# EAGLE design RFToy (EAGLE 7.1.0)
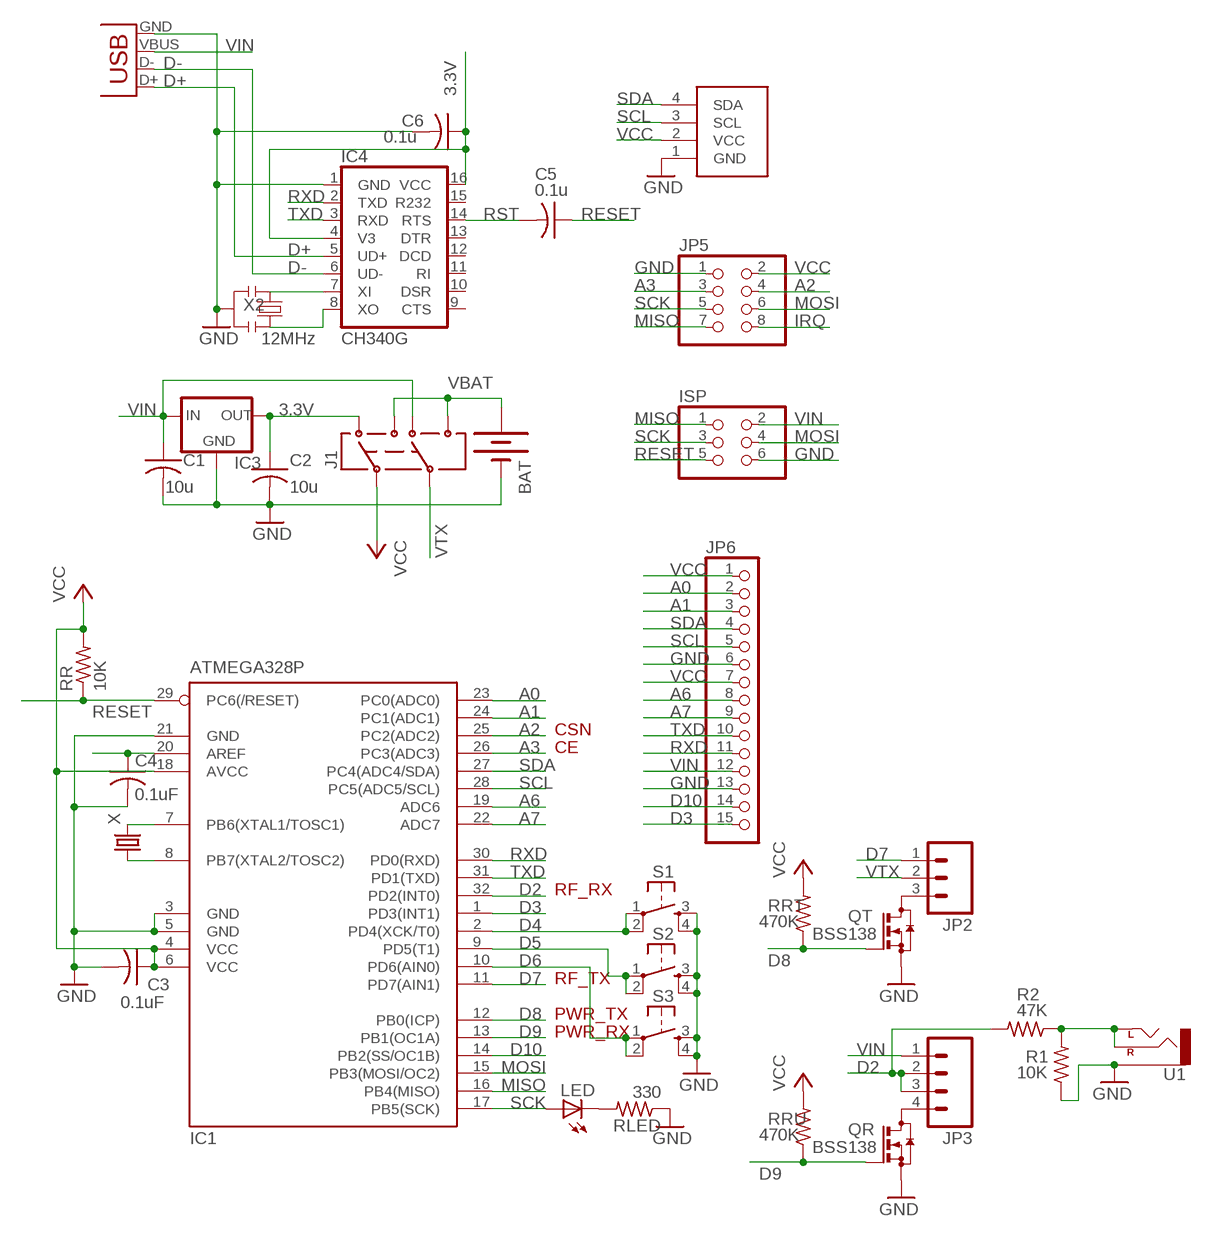
[diagram p0: schematic, sheet 1]

## Parts
BAT  BATTERY20PTH  [BATTCOM_20MM_PTH]
C1  10u  C-USC0805K  [C0805K]
C2  10u  C-USC0805K  [C0805K]
C3  0.1uF  C-USC0805K  [C0805K]
C4  0.1uF  C-USC0805K  [C0805K]
C5  0.1u  C-USC0805K  [C0805K]
C6  0.1u  C-USC0805K  [C0805K]
IC1  ATMEGA328P  MEGA8-AI  [TQFP32-08]
IC3  MCP1700SOT233  [SOT23]
IC4  CH340G  [SO16]
ISP  PINHD-2X3  [2X03]
J1  AYZ0202  [AYZ0202]
JP2  M03LOCK_LONGPADS  [1X03_LOCK_LONGPADS]
JP3  M04LOCK  [1X04_LOCK]
JP5  PINHD-2X4  [2X04]
JP6  PINHD-1X15-CB  [1X15-CB]
LED  LEDCHIPLED_0805  [CHIPLED_0805]
QR  BSS138  BSS123  [SOT23]
QT  BSS138  BSS123  [SOT23]
R1  10K  R-US_R0805  [R0805]
R2  47K  R-US_R0805  [R0805]
RLED  330  R-US_R0805  [R0805]
RR  10K  R-US_R0805  [R0805]
RRT  470K  R-US_R0805  [R0805]
RRU  470K  R-US_R0805  [R0805]
S1  TAC_SWITCHPTH  [TACTILE-PTH]
S2  TAC_SWITCHPTH  [TACTILE-PTH]
S3  TAC_SWITCHPTH  [TACTILE-PTH]
U1  AUDIO-JACKPTH  [AUDIO-JACK]
U$1  SSD1306_OLED_I2C  [SSD1306_OLED_I2C]
X  CRYSTALTC26V  [TC26V]
X1  USBSMD  [USB-MINIB]
X2  12MHz  RESONATORSMD  [RESONATOR-SMD]

## Nets
3.3V [power]: C2.1 C6.1 IC3.2(OUT) IC4.4(V3) IC4.16(VCC) J1.3
A0: IC1.23(PC0(ADC0)) JP6.2
A1: IC1.24(PC1(ADC1)) JP6.3
A2: IC1.25(PC2(ADC2)) JP5.4
A3: IC1.26(PC3(ADC3)) JP5.3
A6: IC1.19(ADC6) JP6.8
A7: IC1.22(ADC7) JP6.9
AREF: C4.1 IC1.20(AREF)
D2: IC1.32(PD2(INT0)) JP3.2 JP3.3 R2.2
D3: IC1.1(PD3(INT1)) JP6.15
D4: IC1.2(PD4(XCK/T0)) S1.1 S1.2
D5: IC1.9(PD5(T1)) S2.1 S2.2
D6: IC1.10(PD6(AIN0)) S3.1 S3.2
D7: IC1.11(PD7(AIN1)) JP2.1
D8: IC1.12(PB0(ICP)) QT.1(G) RRT.1
D9: IC1.13(PB1(OC1A)) QR.1(G) RRU.1
D10: IC1.14(PB2(SS/OC1B)) JP6.14
D+: IC4.5(UD+) X1.D+
D-: IC4.6(UD-) X1.D-
GND [power]: BAT.2(-) C1.2 C2.2 C3.2 C4.2 C6.2 IC1.3(GND) IC1.5(GND) IC1.21(GND) IC3.1(GND) IC4.1(GND) ISP.6 JP5.1 JP6.6 JP6.13 QR.2(S) QT.2(S) R1.1 RLED.1 S1.3 S1.4 S2.3 S2.4 S3.3 S3.4 U1.SLEEVE U$1.1(GND) X1.GND X2.2
IRQ: JP5.8
MISO: IC1.16(PB4(MISO)) ISP.1 JP5.7
MOSI: IC1.15(PB3(MOSI/OC2)) ISP.4 JP5.6
N$1: LED.C RLED.2
N$2: IC1.7(PB6(XTAL1/TOSC1)) X.2
N$3: IC1.8(PB7(XTAL2/TOSC2)) X.1
N$4: R1.2 R2.1 U1.RING(RIGHT) U1.TIP(LEFT)
N$6: JP3.4 QR.3(D)
N$8: JP2.3 QT.3(D)
N$11: IC4.7(XI) X2.1
N$13: IC4.8(XO) X2.3
RESET: C5.1 IC1.29(PC6(/RESET)) ISP.5 RR.1
RST: C5.2 IC4.14(RTS)
RXD: IC1.30(PD0(RXD)) IC4.2(TXD) JP6.11
SCK: IC1.17(PB5(SCK)) ISP.3 JP5.5 LED.A
SCL: IC1.28(PC5(ADC5/SCL)) JP6.5 U$1.3(SCL)
SDA: IC1.27(PC4(ADC4/SDA)) JP6.4 U$1.4(SDA)
TXD: IC1.31(PD1(TXD)) IC4.3(RXD) JP6.10
VBAT [power]: BAT.1(+) J1.1 J1.4
VCC: C3.1 IC1.4(VCC) IC1.6(VCC) IC1.18(AVCC) J1.2 JP5.2 JP6.1 JP6.7 RR.2 RRT.2 RRU.2 U$1.2(VCC)
VIN [power]: C1.1 IC3.3(IN) ISP.2 J1.6 JP3.1 JP6.12 X1.VBUS
VTX [power]: J1.5 JP2.2
Unconnected: IC4.9(CTS) IC4.10(DSR) IC4.11(RI) IC4.12(DCD) IC4.13(DTR) IC4.15(R232)

## Notes on the sheet
- CSN
- CE
- RF_RX
- RF_TX
- PWR_TX
- PWR_RX

## Library data of the parts
BAT = SparkFun:BATTERY: Battery Holders Various common sizes : AA, AAA, 20mm coin cell and 12mm coin cell.
C1-C4 = adafruit2013:C-US: CAPACITOR, American symbol
C5 C6 = adafruit:C-US: CAPACITOR, American symbol
IC1 = atmel:MEGA8: MICROCONTROLLER 8 Kbytes FLASH, 1 kbytes SRAM, 512 bytes EEPROM, USART, 6-channel 10 bit ADC, 2-channel 8 bit ADC Pin compatible with Atmega48, ATMega88, ATMega168 Source: avr.lbr; MPN: ATMEGA8-16AU; OC_FARNELL: 9171371; OC_NEWARK: 73M8863
IC3 = adafruit:MCP1700: VOLTAGE REGULATOR
IC4 = SparkFunNew:CH340
ISP = pinhead:PINHD-2X3: PIN HEADER
J1 = SparkFunNew:AYZ0202: SPDT Slide Switch Simple SMD single-pull double-throw slide switch. Good for less than 350mA power switch, switching UARTs between devices, etc. Spark Fun Electronics SKU : COM-00597
JP2 = SparkFun:M03: Header 3 Standard 3-pin 0.1" header. Use with straight break away headers (SKU : PRT-00116), right angle break away headers (PRT-00553), swiss pins (PRT-00743), machine pins (PRT-00117), and female headers (PRT-00115). Molex polarized connector foot print use with SKU : PRT-08232 with associated crimp pins and housings.
JP3 = SparkFun:M04: Header 4 Standard 4-pin 0.1" header. Use with straight break away headers (SKU : PRT-00116), right angle break away headers (PRT-00553), swiss pins (PRT-00743), machine pins (PRT-00117), and female headers (PRT-00115). Molex polarized connector foot print use with SKU : PRT-08231 with associated crimp pins and housings.
JP5 = adafruit2013:PINHD-2X4: PIN HEADER
JP6 = adafruit2013:PINHD-1X15: PIN HEADER
LED = adafruit:LED: LED OSRAM: - CHIPLED LG R971, LG N971, LY N971, LG Q971, LY Q971, LO R971, LY R971 LH N974, LH R974 LS Q976, LO Q976, LY Q976 LO Q996 - Hyper CHIPLED LW Q18S LB Q993, LB Q99A, LB R99A - SideLED LS A670, LO A670, LY A670, LG A670, LP A670 LB A673, LV A673, LT A673, LW A673 LH A674 LY A675 LS A676, LA A676, LO A676, LY A676, LW A676 LS A679, LY A679, LG A679 - Hyper Micro SIDELED® LS Y876, LA Y876, LO Y876, LY Y876 LT Y87S - SmartLED LW L88C, LW L88S LB L89C, LB L89S, LG L890 LS L89K, LO L89K, LY L89K LS L896, LA L896, LO L896, LY L896 - TOPLED LS T670, LO T670, LY T670, LG T670, LP T670 LSG T670, LSP T670, LSY T670, LOP T670, LYG T670 LG T671, LOG T671, LSG T671 LB T673, LV T673, LT T673, LW T673 LH T674 LS T676, LA T676, LO T676, LY T676, LB T676, LH T676, LSB T676, LW T676 LB T67C, LV T67C, LT T67C, LS T67K, LO T67K, LY T67K, LW E67C LS E67B, LA E67B, LO E67B, LY E67B, LB E67C, LV E67C, LT E67C LW T67C LS T679, LY T679, LG T679 LS T770, LO T770, LY T770, LG T770, LP T770 LB T773, LV T773, LT T773, LW T773 LH T774 LS E675, LA E675, LY E675, LS T675 LS T776, LA T776, LO T776, LY T776, LB T776 LHGB T686 LT T68C, LB T68C - Hyper Mini TOPLED® LB M676 - Mini TOPLED Santana® LG M470 LS M47K, LO M47K, LY M47K Source: http://www.osram.convergy.de/
QR QT = transistor-small-signal:BSS123: N-CHANNEL MOS FET
R1 R2 RLED RR RRT RRU = adafruit2013:R-US_: RESISTOR, American symbol
S1-S3 = SparkFunNew:TAC_SWITCH: Momentary Switch Button commonly used for reset or general input. Spark Fun Electronics SKU : COM-00097
U1 = SparkFunNew:AUDIO-JACK: 3.5mm Audio Jack Simple 3.5mm common PCB mount audio jack. SKU: PRT-08032
U$1 = adafruit2013:SSD1306_OLED_I2C
X = adafruit2013:CRYSTAL: CRYSTAL; OC_FARNELL: unknown; OC_NEWARK: unknown
X1 = SparkFun:USB: USB Connectors USB-B-PTH is fully proven SKU : PRT-00139 USB-miniB is fully proven SKU : PRT-00587 USB-A-PCB is untested. USB-A-H is throughly reviewed, but untested. Spark Fun Electronics SKU : PRT-00437 USB-B-SMT is throughly reviewed, but untested. Needs silkscreen touching up. USB-A-S has not been used/tested USB-MB-H has not been used/tested
X2 = SparkFunNew:RESONATOR: Resonator Small SMD resonator. This is the itty bitty 10/20MHz resonators with built in caps. CSTCE10M0G55 and CSTCE20M0V53. Footprint has been reviewed closely but hasn't been tested yet.

## Net classes
0 default: width 0.178 mm, clearance 0.178 mm
1 power: width 0.203 mm, clearance 0.203 mm

## Board
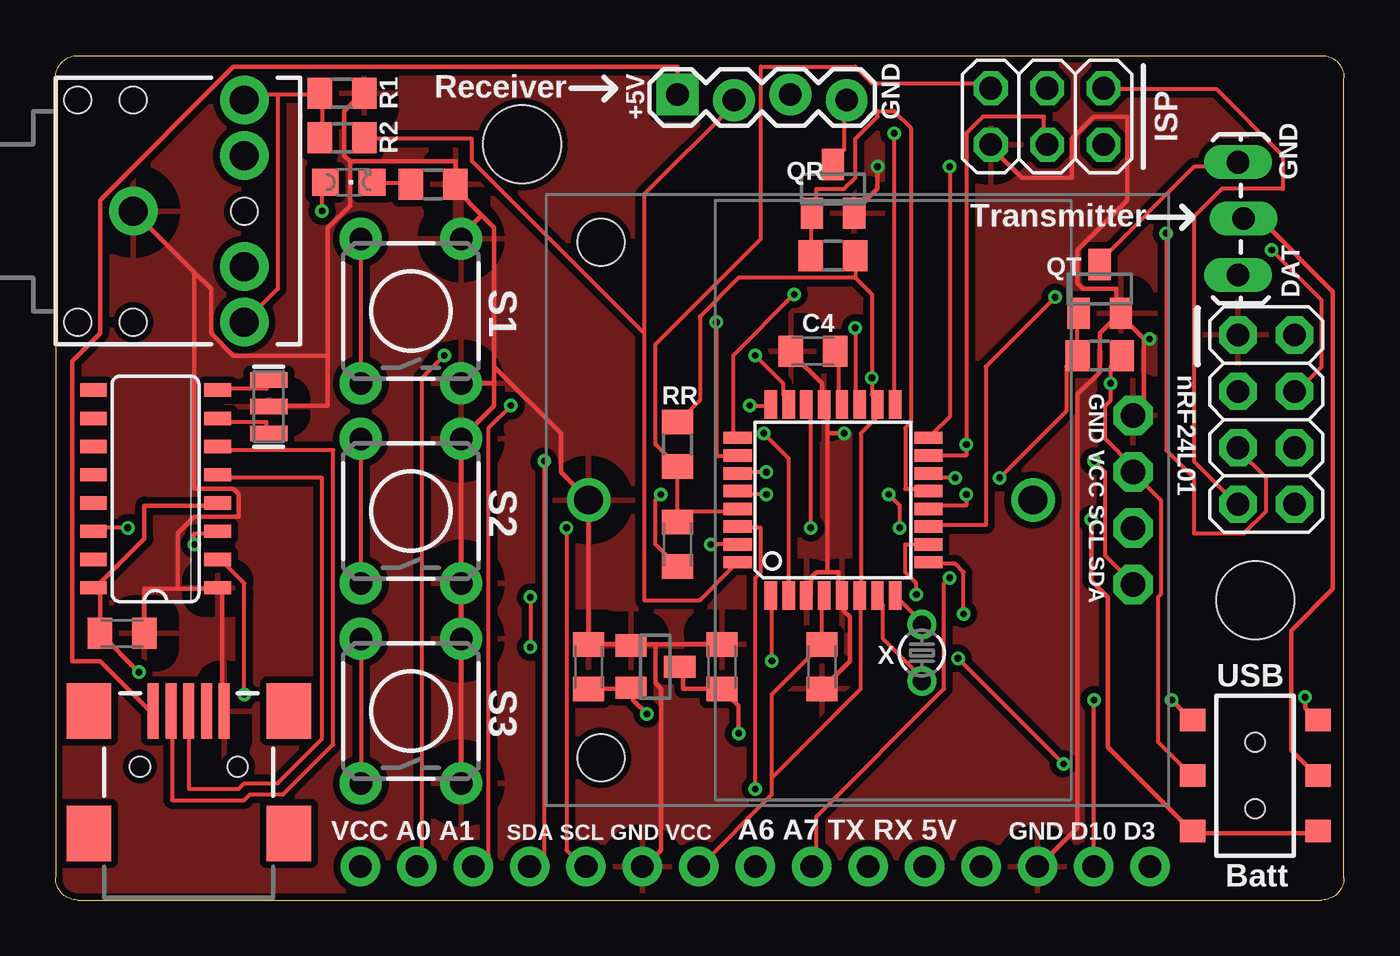
[diagram p1: board, top side]
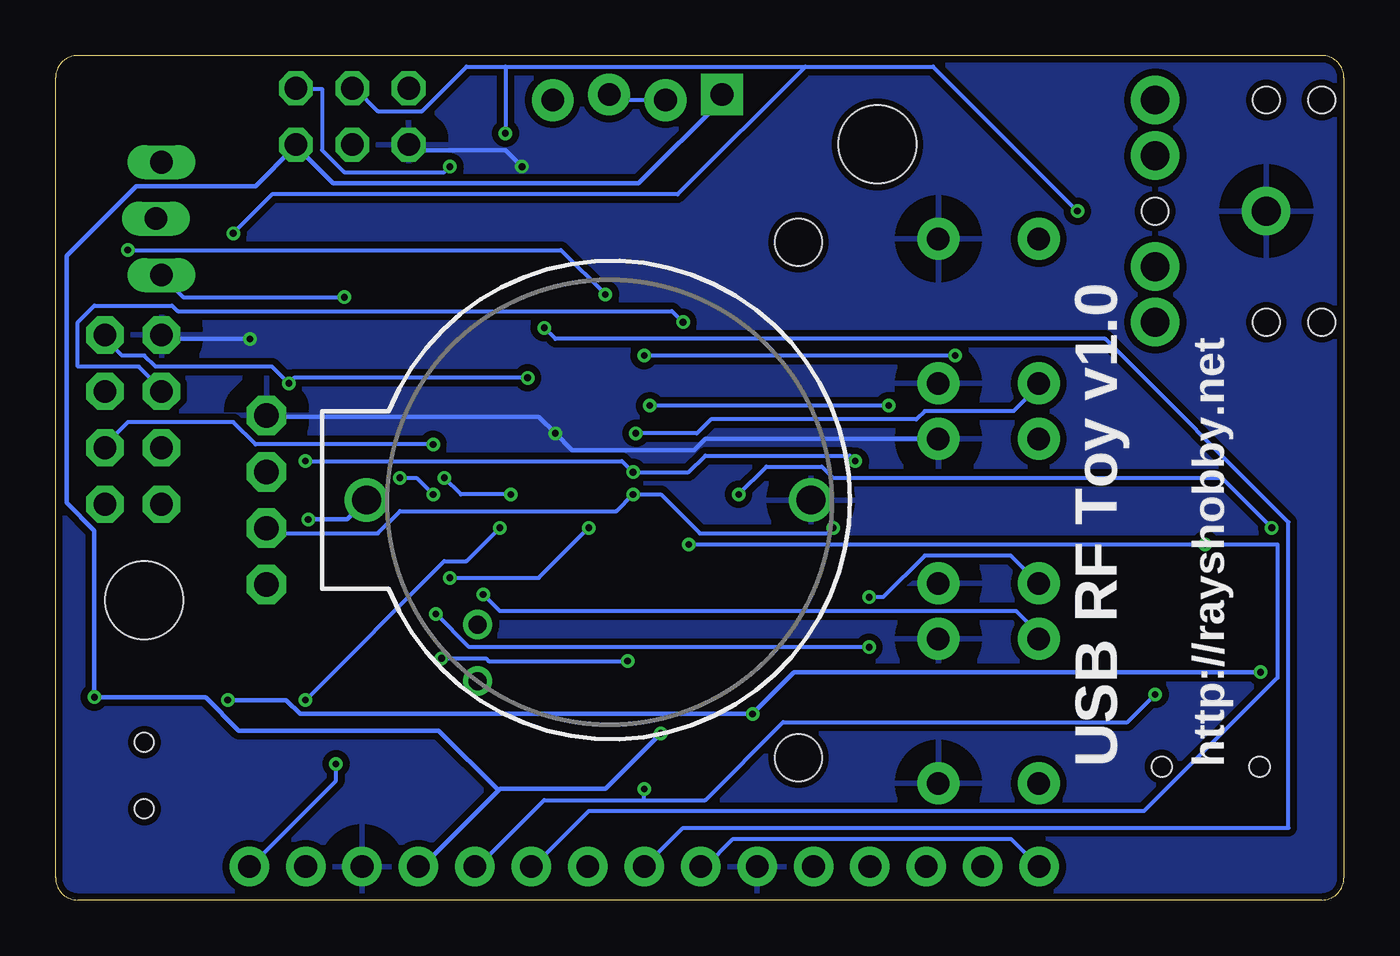
[diagram p2: board, bottom side, seen from below]

Size 58 x 38 mm. Coordinates in mm from the lower left corner, seen from the top.
Outline: 0,37 0,1 arc90 1,0 57,0 arc90 58,1 58,37 arc90 57,38 1,38 arc90 0,37
Copper layers (1*16): Top 0.035mm / dielectric 1.5mm / Bottom 0.035mm
Design rules "Fusion_eagle_rule_v1.1 *": minimum track width 6mil, minimum drill 12mil, track to track 6mil, track to pad 6mil, pad to pad 6mil, via to via 6mil, smd to smd 0mil, copper to edge 10mil, drill to drill 10mil, minimum pad ring 10mil, minimum via ring 6mil, stop-mask expansion 2mil, vias tented up to drill 100mil, thermal gap 40mil
Holes 3.5 mm at 21,34 54,13.5
vRestrict: area 50.5,17.8 to 51.3,23.6; area 55.2,27.1 to 56,29.2; area 55.1,32.4 to 55.9,34.5; area 37.2,35.1 to 38,37.2; area 25.7,35.1 to 26.5,37.2

### Footprints (pad centres in the part's own frame; a part is rotated, then mirrored left to right if it is on the bottom)
BATTCOM_20MM_PTH = drill 1.3: 1 20,0; 2 0,0
C0805K = smd 1.1 x 1.4: 1 -1,0; 2 1,0
TQFP32-08 = smd 1.27 x 0.559: 1 -4.293,2.8; 2 -4.293,2; 3 -4.293,1.2; 4 -4.293,0.4; 5 -4.293,-0.4; 6 -4.293,-1.2; 7 -4.293,-2; 8 -4.293,-2.8; 17 4.293,-2.8; 18 4.293,-2; 19 4.293,-1.2; 20 4.293,-0.4; 21 4.293,0.4; 22 4.293,1.2; 23 4.293,2; 24 4.293,2.8 | smd 0.559 x 1.27: 9 -2.8,-4.293; 10 -2,-4.293; 11 -1.2,-4.293; 12 -0.4,-4.293; 13 0.4,-4.293; 14 1.2,-4.293; 15 2,-4.293; 16 2.8,-4.293; 25 2.8,4.293; 26 2,4.293; 27 1.2,4.293; 28 0.4,4.293; 29 -0.4,4.293; 30 -1.2,4.293; 31 -2,4.293; 32 -2.8,4.293
SOT23 = smd 1 x 1.4: 1 -0.95,-1.1; 2 0.95,-1.1; 3 0,1.1
SO16 = smd 0.6 x 1.2: 1 -4.445,-2.8; 2 -3.175,-2.8; 3 -1.905,-2.8; 4 -0.635,-2.8; 5 0.635,-2.8; 6 1.905,-2.8; 7 3.175,-2.8; 8 4.445,-2.8; 9 4.445,2.8; 10 3.175,2.8; 11 1.905,2.8; 12 0.635,2.8; 13 -0.635,2.8; 14 -1.905,2.8; 15 -3.175,2.8; 16 -4.445,2.8
2X03 = drill 1.016 octagon: 1 -2.54,-1.27; 2 -2.54,1.27; 3 0,-1.27; 4 0,1.27; 5 2.54,-1.27; 6 2.54,1.27
AYZ0202 = smd 1 x 1.15: 1 -2.5,2.825; 2 0,2.825; 3 2.5,2.825; 4 -2.5,-2.825; 5 0,-2.825; 6 2.5,-2.825 | hole 0.85: 1.5,0; -1.5,0
1X03_LOCK_LONGPADS = drill 1.016 long: 1 0,0; 2 2.54,-0.254; 3 5.08,0
1X04_LOCK = drill 1.016 pad 1.88 square: 1 0,0.127 | drill 1.016 pad 1.88: 2 2.54,-0.127; 3 5.08,0.127; 4 7.62,-0.127
2X04 = drill 1.016 pad 1.676 octagon: 1 -3.81,-1.27; 2 -3.81,1.27; 3 -1.27,-1.27; 4 -1.27,1.27; 5 1.27,-1.27; 6 1.27,1.27; 7 3.81,-1.27; 8 3.81,1.27
1X15-CB = drill 1.016 pad 1.778: 1 -17.78,0; 2 -15.24,0; 3 -12.7,0; 4 -10.16,0; 5 -7.62,0; 6 -5.08,0; 7 -2.54,0; 8 0,0; 9 2.54,0; 10 5.08,0; 11 7.62,0; 12 10.16,0; 13 12.7,0; 14 15.24,0; 15 17.78,0
CHIPLED_0805 = smd 1.2 x 1.2: A 0,-1.05; C 0,1.05
R0805 = smd 1.1 x 1.4: 1 -1,0; 2 1,0
TACTILE-PTH = drill 1.016 pad 1.88: 1 -3.251,2.261; 2 3.251,2.261; 3 -3.251,-2.261; 4 3.251,-2.261
AUDIO-JACK = drill 1.3 pad 2.184: RING 5,5; RSH 5,2.5; SLEEVE 0,0; TIP 5,-5; TSH 5,-2.5 | hole 1.2: 0,5; -2.5,5; -2.5,-5; 0,-5; 5,0
SSD1306_OLED_I2C = drill 1.1 pad 1.778 octagon: 1 -3.81,0; 2 -1.27,0; 3 1.27,0; 4 3.81,0 | hole 2.1: 11.6,-23.95; -11.6,-23.95
TC26V = drill 0.813: 1 -1.27,0; 2 1.27,0
USB-MINIB = smd 2.5 x 0.5: D+ 2.5,0; D- 2.5,0.8; GND 2.5,-1.6; ID 2.5,-0.8; VBUS 2.5,1.6 | smd 2.5 x 2: GND@1 -3,-4.5; GND@2 -3,4.5; GND@3 2.5,4.5; GND@4 2.5,-4.5 | hole 0.9: 0,2.2; 0,-2.2
RESONATOR-SMD = smd 0.7 x 1.7: 1 -1.2,0; 2 0,0; 3 1.2,0

### Placement (x,y rotation side)
BAT  24,18 180 bottom
C1  30,10.5 90 top
C2  24,10.5 90 top
C3  34.5,10.5 270 top
C4  34.1,24.7 180 top
C5  28,16 270 top
C6  3,12 0 top
IC1  35,18 90 top
IC3  27,10.5 270 top
IC4  4.5,18.5 90 top
ISP  44.64,35.26 180 top
J1  54,5.6 90 top
JP2  53.23,28.12 90 top
JP3  28,36.12 0 top
JP5  54.5,21.62 270 top
JP6  31.5,1.5 0 top
LED  13.2,32.3 270 top
QR  35,32 0 top
QT  47,27.5 0 top
R1  12.9,36.3 180 top
R2  12.9,34.3 0 top
RLED  17,32.2 180 top
RR  28,20.5 90 top
RRT  47,24.5 0 top
RRU  35,29 0 top
S1  16,26.5 90 top
S2  16,17.5 90 top
S3  16,8.5 90 top
U1  3.5,31 0 top
U$1  48.5,18 270 top
X  39,11.12 270 top
X1  6,6 90 top
X2  9.6,22.2 90 top

### Tracks (layer width: path | path; a pad name or v marks a point on that pad's centre or on a via)
3.3V  (via drill 0.3)
  Top 0.203: 1.75,14 2,13.75 C6.1 v3.75,10.25 | 1.75,14 4,16.25 4,17.75 7.25,17.75 IC4.4 | 1.75,14 IC4.16 | C2.1 25.75,9.5 IC3.2 26,9.5 26,9 v26.62,8.38 | v50.25,9 51.12,8.12 J1.3
  Bottom 0.203: v50.25,9 47.62,9 47,8.38 v26.62,8.38 24.75,10.25 v3.75,10.25
A0  (via drill 0.3)
  Top 0.178: v31.5,24.5 32.75,23.25 32.75,22.75 33,22.5 IC1.23 | v17.5,24.5 16.5,23.5 16.5,1.5 JP6.2
  Bottom 0.178: v17.5,24.5 v31.5,24.5
A1  (via drill 0.3)
  Top 0.178: v31.25,22.25 32,22.25 IC1.24 | v20.5,22.25 19.5,21.25 19.5,2 19,1.5 JP6.3
  Bottom 0.178: v20.5,22.25 v31.25,22.25
A2  (via drill 0.3)
  Top 0.178: v33.25,27.25 30.5,24.5 30.5,21 IC1.25 | v54.75,29.25 57,27 57,24 56,23 JP5.4
  Bottom 0.178: v33.25,27.25 35.25,29.25 v54.75,29.25
A3  (via drill 0.3)
  Top 0.178: IC1.26 29.75,20 v29.75,26
  Bottom 0.178: v29.75,26 30.25,26.5 52.5,26.5 52.75,26.75 56.25,26.75 57,26 57,24 54.25,24 53.25,23 JP5.3
A6  (via drill 0.3)
  Top 0.178: v36,25.75 36,22.5 IC1.19
  Bottom 0.178: v36,25.75 35.5,25.25 10.75,25.25 2.5,17 2.5,3.25 29.75,3.25 JP6.8
A7  (via drill 0.3)
  Top 0.178: v34,16.75 34,22.25 IC1.22 | v40.25,14.5 40,14.25 40,9.5 34.25,3.75 34.25,1.5 JP6.9
  Bottom 0.178: v34,16.75 36.25,14.5 v40.25,14.5
AREF
  Top 0.178: IC1.20 35.25,22.5 35.25,24.5 C4.1
D2
  Top 0.178: 26.5,25.5 26.5,31.75 30.5,35.75 JP3.2 | 26.5,25.5 26.5,13.5 29,13.5 30.5,15 IC1.32 | 26.5,25.5 18.75,33.25 18.75,34.25 14,34.25 R2.2
  Bottom 0.178: JP3.3 33,36 30.75,36 JP3.2
D3  (via drill 0.3)
  Top 0.178: v32.25,10.75 32.25,13.62 IC1.1 | v45.38,6.12 v40.62,10.88
  Bottom 0.178: v32.25,10.75 38.5,10.75 38.62,10.88 v40.62,10.88 | v45.38,6.12 45.38,5.38 49.25,1.5 JP6.15
D4  (via drill 0.3)
  Top 0.178: IC1.2 33,19.88 v31.88,21 | S1.2 S1.1
  Bottom 0.178: v31.88,21 29.12,21 28.5,21.62 19.25,21.62 18.88,22 14.88,22 13.75,23.12 S1.1
D5  (via drill 0.3)
  Top 0.178: v40.88,12.88 40.88,14.75 40.5,15.12 39.38,15.12 IC1.9 | v21.38,13.62 v21.38,11.38 | S2.2 S2.1
  Bottom 0.178: v40.88,12.88 39.38,11.38 v21.38,11.38 | v21.38,13.62 20.75,13.62 18.88,15.5 15,15.5 S2.1
D6  (via drill 0.3)
  Top 0.178: IC1.10 38.25,16 38.25,14.75 38.75,14.25 v38.75,13.75 | S3.1 S3.2
  Bottom 0.178: v38.75,13.75 38,13 14.75,13 13.75,12 S3.2
D7  (via drill 0.3)
  Top 0.178: v45,27.12 41.88,24 41.88,16.88 39.38,16.88 IC1.11
  Bottom 0.178: v45,27.12 52.25,27.12 53.12,28 JP2.1
D8  (via drill 0.3)
  Top 0.178: v41,18.25 41,17.75 39.5,17.75 IC1.12 | v42.5,19 45.5,22 45.5,24 RRT.1 46,26.25 QT.1
  Bottom 0.178: v41,18.25 41.75,19 v42.5,19
D9
  Top 0.178: IC1.13 39.25,18.5 38.25,18.5 38.25,21.25 38.5,21.5 38.5,34.75 37.75,35.5 37,35.5 37,35.25 36,34.25 36,32.5 35.5,32 34.25,32 34.25,31 QR.1 34,30.75 RRU.1
D10  (via drill 0.3)
  Top 0.178: v40.5,19 39.5,19 IC1.14 | v37.5,18.25 38,17.75 v38,16.75 | v46.75,9 JP6.14
  Bottom 0.178: v40.5,19 39.75,18.25 v37.5,18.25 | v38,16.75 39.5,15.25 40.5,15.25 v46.75,9
D+
  Top 0.178: X1.D+ 6,5 8.25,5 8.5,5.25 10,5.25 12,7.25 12,19 7.5,19 IC4.5
D-
  Top 0.178: IC4.6 7.5,20.25 12.5,20.25 12.5,7 10.25,4.75 8.75,4.75 8.5,4.5 5.25,4.5 5.25,8.5 X1.D-
GND  (via drill 0.3)
  Top 0.203: C4.2 33.25,24.5 34.5,23.25 34.5,22.5 IC1.21 34.75,22.25 34.75,21 | 34.75,14.75 35.25,14.75 35.25,13.75 IC1.5 35.5,13.5 35.5,13 35.75,12.75 35.75,10.75 C3.2 | 34.75,14.75 34.25,14.75 34,14.5 34,13.75 IC1.3 | 34.75,14.75 34.75,21 | v37,33 37,32 36,31 QR.2 | 49,25.25 48,26.25 QT.2 | 49,25.25 49,22.5 48.5,22 U$1.1 | 49,25.25 v49.25,25.25 | JP6.13 44.25,1.5 46,3.25 46,22.75 47,23.75 47,25.5 47.75,26.25 QT.2 | ISP.6 42.25,33.75 43.5,32.5 45.75,32.5 45.75,34.25 46.75,35.25 48.25,35.25 48.25,31.5 46,29.25 46,27.75 46.25,27.5 47.75,27.5 47.75,26.5 QT.2 | v35.5,21 34.75,21 | 27,11.5 26,11.5 IC3.1 25.75,11.5 C2.2 BAT.2 22.75,19.25 22.75,21 19.75,24 | 27,11.5 C1.2 | 27,11.5 27,9.75 27.25,9.5 27.25,2.25 26.5,1.5 JP6.6 | S3.3 S3.4 18.25,12 18.25,14 S2.3 S2.4 18.5,21 19.75,22.25 19.75,23.25 | 5.5,14 4,14 C6.2 | 5.5,14 7.25,14 IC4.1 7.5,14 7.5,8.5 X1.GND | 13.25,33.25 13,33.5 13,35.5 13.75,36.25 R1.1 | 13.25,33.25 18,33.25 RLED.1 18,32 19.19,30.81 | 12.25,24.5 12.25,30.25 13.25,31.25 13.25,33.25 | 12.25,24.5 12.25,22.25 9.75,22.25 X2.2 | 6.25,28.25 7,27.5 7,25.5 8,24.5 12.25,24.5 | 6.25,28.25 U1.SLEEVE | 5.5,14 5.5,16.5 6.25,17.25 8.25,17.25 8.25,18.25 8,18.5 6.25,18.5 6.25,28.25 | 19.75,24 19.75,30.25 19.19,30.81 | 19.75,24 19.75,23.25 | 19.75,23.25 18.38,23.25 S1.3 | 19.19,30.81 18.25,29.88 S1.4
  Bottom 0.203: v37,33 37.75,33.75 42,33.75 ISP.6 | v49.25,25.25 53,25.25 JP5.1 | U$1.1 48.5,21.75 36.25,21.75 v35.5,21 34.75,20.25 29.25,20.25 28.75,20.75 18.5,20.75 S2.4
  pour Top (isolate 0.305): 0,38 58,38 58,0 0,0
  pour Bottom (isolate 0.305): 0,38 58,38 58,0 0,0
MISO  (via drill 0.3)
  Top 0.178: v40.25,33 40.25,21.75 39.5,21 IC1.16 | JP5.7 53,18 51.25,19.75 51.25,30.75 52.5,32 55.25,32 55.25,33.5 52.25,36.5 47.25,36.5 ISP.1
  Bottom 0.178: v40.25,33 40.5,32.75 45,32.75 46,33.75 46,36.5 47,36.5 ISP.1
MOSI  (via drill 0.3)
  Top 0.178: IC1.15 41,20 v41,20.5 41,34.5 41.75,35.25 44.5,35.25 44.5,34 ISP.4
  Bottom 0.178: v41,20.5 49,20.5 50,21.5 54.75,21.5 55.75,20.5 JP5.6
N$1
  Top 0.178: LED.C 14.25,32.25 16,32.25 RLED.2
N$2
  Top 0.178: IC1.7 37,13.5 37.25,13.25 37.25,11.75 39,10 X.2
N$3
  Top 0.178: IC1.8 38,13.5 39,12.5 X.1
N$4
  Top 0.178: R2.1 12,34.5 12,36.25 R1.2 11.75,36.25 10,36.25 | 10,36.25 8.5,36.25 U1.RING | U1.TIP 10,27.5 10,36.25
N$6
  Top 0.178: QR.3 35,33.25 35.5,33.75 35.5,35.75 JP3.4
N$8
  Top 0.178: QT.3 47,28.75 51.25,33 53,33 JP2.3
N$11
  Top 0.178: IC4.7 7.5,21.5 9.5,21.5 9.5,21 X2.1
N$13
  Top 0.178: IC4.8 7.5,23 9.5,23 9.5,23.25 X2.3
RESET
  Top 0.178: 28,17.5 30.5,17.5 IC1.29 | 28,17.5 RR.1 27,20.5 27,25 31.75,29.75 31.75,37.5 36,37.5 36.75,36.75 42,36.75 ISP.5 | 28,17.5 C5.1
RST  (via drill 0.3)
  Top 0.178: v3.25,16.75 1.75,16.75 IC4.14 | v27.25,18.25 27,18 27,16 C5.2
  Bottom 0.178: v3.25,16.75 5.5,19 23,19 23.5,19.5 26,19.5 v27.25,18.25
RXD  (via drill 0.3)
  Top 0.178: v8.5,9.25 8.5,14.25 7.5,15.25 IC4.2 | v31.5,5 31.5,14.5 31.75,14.75 31.75,16.75 30.75,16.75 IC1.30
  Bottom 0.178: v8.5,9.25 9.75,8 25.25,8 28.75,4.5 31.5,4.5 | 31.5,4.5 36,4.5 39,1.5 JP6.11 | 31.5,4.5 v31.5,5
SCK  (via drill 0.3)
  Top 0.178: v12,31 12,32.25 LED.A | v37.75,34.5 37.75,22.5 IC1.17 | v50,30 50,20.25 51.25,19 51.25,16.5 53.5,16.5 54.5,17.5 54.5,19 53.25,20.25 JP5.5
  Bottom 0.178: v12,31 18.5,37.5 24.25,37.5 | 37.75,37.5 39.5,37.5 41.5,35.5 43.5,35.5 44.5,36.5 ISP.3 | 37.75,37.5 24.25,37.5 | 37.75,37.5 v37.75,34.5 | v50,30 48.25,31.75 30,31.75 24.25,37.5
SCL  (via drill 0.3)
  Top 0.178: v32,18.25 30.75,18.25 IC1.28 | v23,16.75 23,2.25 23.75,1.5 JP6.5
  Bottom 0.178: U$1.3 48.5,16.5 43.5,16.5 42.5,17.5 32.75,17.5 v32,18.25 30.75,18.25 29,16.5 23.25,16.5 v23,16.75
SDA  (via drill 0.3)
  Top 0.178: v32,19.25 30.75,19.25 IC1.27 | v46.75,19.75 47.25,19.25 47.25,15.5 48.5,14.25 U$1.4 | v22,19.75 22,2 21.5,1.5 JP6.4
  Bottom 0.178: v46.75,19.75 32.5,19.75 v32,19.25 29.5,19.25 28.75,20 22.25,20 v22,19.75
TXD  (via drill 0.3)
  Top 0.178: v6.25,16 6.25,16.5 7.25,16.5 IC4.3 | IC1.31 v29.5,16
  Bottom 0.178: v29.5,16 v6.25,16 3,16 3,10 9,4 34,4 36.5,1.5 JP6.10
VBAT  (via drill 0.3)
  Top 0.203: J1.4 57,3 51,3 J1.1 51.12,3.12 47.38,6.88 47.38,13.62 46.62,14.38 v46.62,17.12
  Bottom 0.203: v46.62,17.12 44.88,17.12 BAT.1
VCC  (via drill 0.3)
  Top 0.178: RRT.2 47.5,24 v47.5,23.25 47.5,22.5 47.25,22.25 47.25,20.75 48.5,19.5 U$1.2 48.5,19.25 49.75,18 49.75,13.75 49.62,13.62 49.62,7.12 51.12,5.62 J1.2 | RR.2 29,22.5 29,26.25 30.75,28 36,28 | RRU.2 36,28 | 36,28 36.75,27.25 v36.75,23.5 36.75,22.75 37,22.5 IC1.18 37,21.75 36.25,21 36.25,13.75 IC1.6 36.25,13.5 36.25,9.5 32.25,5.5 | IC1.4 34.5,13.5 C3.1 32.25,9.25 32.25,5.5 | 32.25,5.5 32.25,4.75 29,1.5 JP6.7
  Bottom 0.178: JP5.2 55.75,25.25 55,24.5 54,24.5 53.5,24 48.25,24 v47.5,23.25 47.25,23.5 v36.75,23.5 | JP6.1 13.75,1.5 15,2.75 27.5,2.75 28.75,1.5 JP6.7
VIN  (via drill 0.3)
  Top 0.203: IC3.3 28.25,10.5 28.25,9.5 C1.1 30.75,8.75 v30.75,7.5 | JP3.1 28,37.5 8,37.5 2,31.5 2,25.5 0.75,24.25 0.75,10.75 2,10.75 4.25,8.5 X1.VBUS | v56.25,9.12 56.25,8.62 56.75,8.12 J1.6
  Bottom 0.203: v30.75,7.5 33.25,5 38,5 38.06,4.94 | 38.06,4.94 41.5,1.5 JP6.12 | JP3.1 28,36 31.75,32.25 45.5,32.25 47,33.75 ISP.2 47.25,33.88 49,32.12 54.38,32.12 57.5,29 57.5,17.88 56.25,16.62 v56.25,9.12 51.25,9.12 49.75,7.62 40.75,7.62 38.06,4.94
VTX
  Top 0.203: J1.5 56.75,5.62 55.62,6.75 55.62,12.12 57.5,14 57.5,27.38 54.25,30.62 53.5,30.62 JP2.2

### Text on the board
tNames: Receiver | +5V | GND | GND | Transmitter | DAT | nRF24L01 | USB | VCC A0 A1 | SDA SCL GND VCC | A6 A7 TX RX 5V | GND D10 D3 | Batt
bNames: http://rayshobby.net | USB RF Toy v1.0